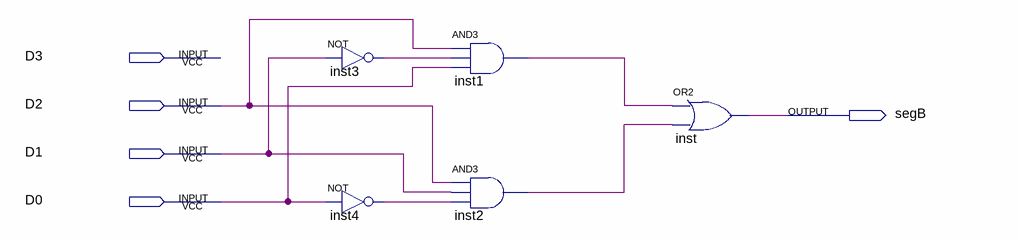
[diagram p0: schematic sheet]
// Quartus schematic segB.bdf as structural Verilog: 5 symbols, 5 pins
module segB (
  input  D3,
  input  D2,
  input  D1,
  input  D0,
  output segB
);

  wire inst1_out, inst2_out, inst3_out, inst4_out;

  not inst3 (inst3_out, D1);
  not inst4 (inst4_out, D0);
  and inst1 (inst1_out, D2, inst3_out, D0);
  and inst2 (inst2_out, D2, D1, inst4_out);
  or inst (segB, inst1_out, inst2_out);
endmodule
